# Altium schematic sheet Power02.SchDoc
size A4
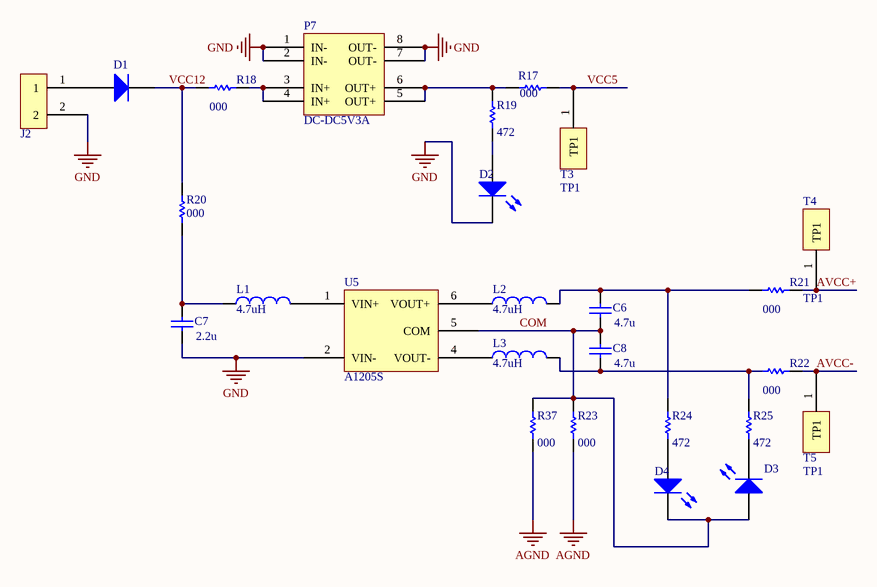
[diagram p0: Power02.SchDoc]

## Parts
C6  value 4.7u  [1206]  (hidden comment: Cap Semi)
C7  value 2.2u  [1206]  (hidden comment: Cap Semi)
C8  value 4.7u  [1206]  (hidden comment: Cap Semi)
D1  LED2  [0805_LED]  (value not drawn)
D2  LED2  [0805_LED]  (value not drawn)
D3  LED2  [0805_LED]  (value not drawn)
D4  LED2  [0805_LED]  (value not drawn)
J2  XK7.62-2P  [XK7.62-2P]  (value not drawn)
L1  value 4.7uH  [1206]  (hidden comment: Inductor)
L2  value 4.7uH  [1206]  (hidden comment: Inductor)
L3  value 4.7uH  [1206]  (hidden comment: Inductor)
P7  DC-DC5V3A  [DC-DC3A]
R17  value 000  [1206]  (hidden comment: Res Semi)
R18  value 000  [1206]  (hidden comment: Res Semi)
R19  value 472  [1206]  (hidden comment: Res Semi)
R20  value 000  [1206]  (hidden comment: Res Semi)
R21  value 000  [1206]  (hidden comment: Res Semi)
R22  value 000  [1206]  (hidden comment: Res Semi)
R23  value 000  [1206]  (hidden comment: Res Semi)
R24  value 472  [1206]  (hidden comment: Res Semi)
R25  value 472  [1206]  (hidden comment: Res Semi)
R37  value 000  [1206]  (hidden comment: Res Semi)
T3  TP1  [TP1]
T4  TP1  [TP1]
T5  TP1  [TP1]
U5  A1205S  [A1205S]

## Nets
AGND: R23.1 R37.1
GND: C7.1 D2.2(K) J2.2 P7.1(IN-) P7.2(IN-) P7.7(OUT-) P7.8(OUT-) U5.2(VIN-)
AVCC+: R21.2 T4.1(TP1)
AVCC-: R22.2 T5.1(TP1)
COM: C6.1 C8.2 D3.1(A) D4.2(K) R23.2 R37.2 U5.5(COM)
VCC5: R17.2 T3.1(TP1)
VCC12: D1.2(K) R18.1 R20.2
NetC6_2: C6.2 L2.2 R21.1 R24.2
NetC7_2: C7.2 L1.1 R20.1
NetC8_1: C8.1 L3.2 R22.1 R25.2
NetD1_1: D1.1(A) J2.1
NetD2_1: D2.1(A) R19.1
NetD3_2: D3.2(K) R25.1
NetD4_1: D4.1(A) R24.1
NetL1_2: L1.2 U5.1(VIN+)
NetL2_1: L2.1 U5.6(VOUT+)
NetL3_1: L3.1 U5.4(VOUT-)
NetP7_3: P7.3(IN+) P7.4(IN+) R18.2
NetP7_5: P7.5(OUT+) P7.6(OUT+) R17.1 R19.2

## Library data of the parts
C6-C8 = Cap Semi: Capacitor (Semiconductor SIM Model); Published: 8-Jun-2000; LatestRevisionDate: 29-May-2009; LatestRevisionNote: IPC-7351 Footprint Added.; PackageReference: C1206; Publisher: Altium Limited; PackageDescription: Chip Capacitor
D1 = Diode 1N4001: 1 Amp General Purpose Rectifier; Published: 8-Jun-2000; LatestRevisionDate: 17-Jul-2002; LatestRevisionNote: Re-released for DXP Platform.; DatasheetVersion: 1998; PackageVersion: Aug-1999; PackageReference: DO-41; Publisher: Altium Limited; Code_JEDEC: DO-204-AL; ComponentLink1Description: Manufacturer Link; ComponentLink1URL: http://www.fairchildsemi.com/; ComponentLink2Description: Datasheet; ComponentLink2URL: http://www.fairchildsemi.com/ds/1N%2F1N4001.pdf
D2-D4 = LED2: Typical RED, GREEN, YELLOW, AMBER GaAs LED; Published: 8-Jun-2000; LatestRevisionDate: 17-Jul-2002; LatestRevisionNote: Re-released for DXP Platform.; PackageVersion: Feb-2002; PackageReference: 3.2X1.6X1.1; Publisher: Altium Limited
L1-L3 = Inductor: Code_IEC: 1005; Published: 8-Jun-2000; LatestRevisionDate: 29-May-2009; LatestRevisionNote: IPC-7351 Footprint Added.; PackageReference: 0402-A; Publisher: Altium Limited; PackageDescription: Chip Inductor; Code_JEITA: 0402
P7 = DC-DC3A
R17-R25 R37 = Res Semi: Semiconductor Resistor; Published: 8-Jun-2000; LatestRevisionDate: 17-Jul-2002; LatestRevisionNote: Re-released for DXP Platform.; PackageReference: AXIAL-0.5; Publisher: Altium Limited